# Altium schematic sheet STM3205P_CurrentMeasure.SchDoc
size A3; Organization: Canis Tech; Address1: -; Address2: -; Address3: -; Address4: Indaiatuba/SP; DocumentNumber: 7; SheetNumber: 7; SheetTotal: 9; Address5: Brazil
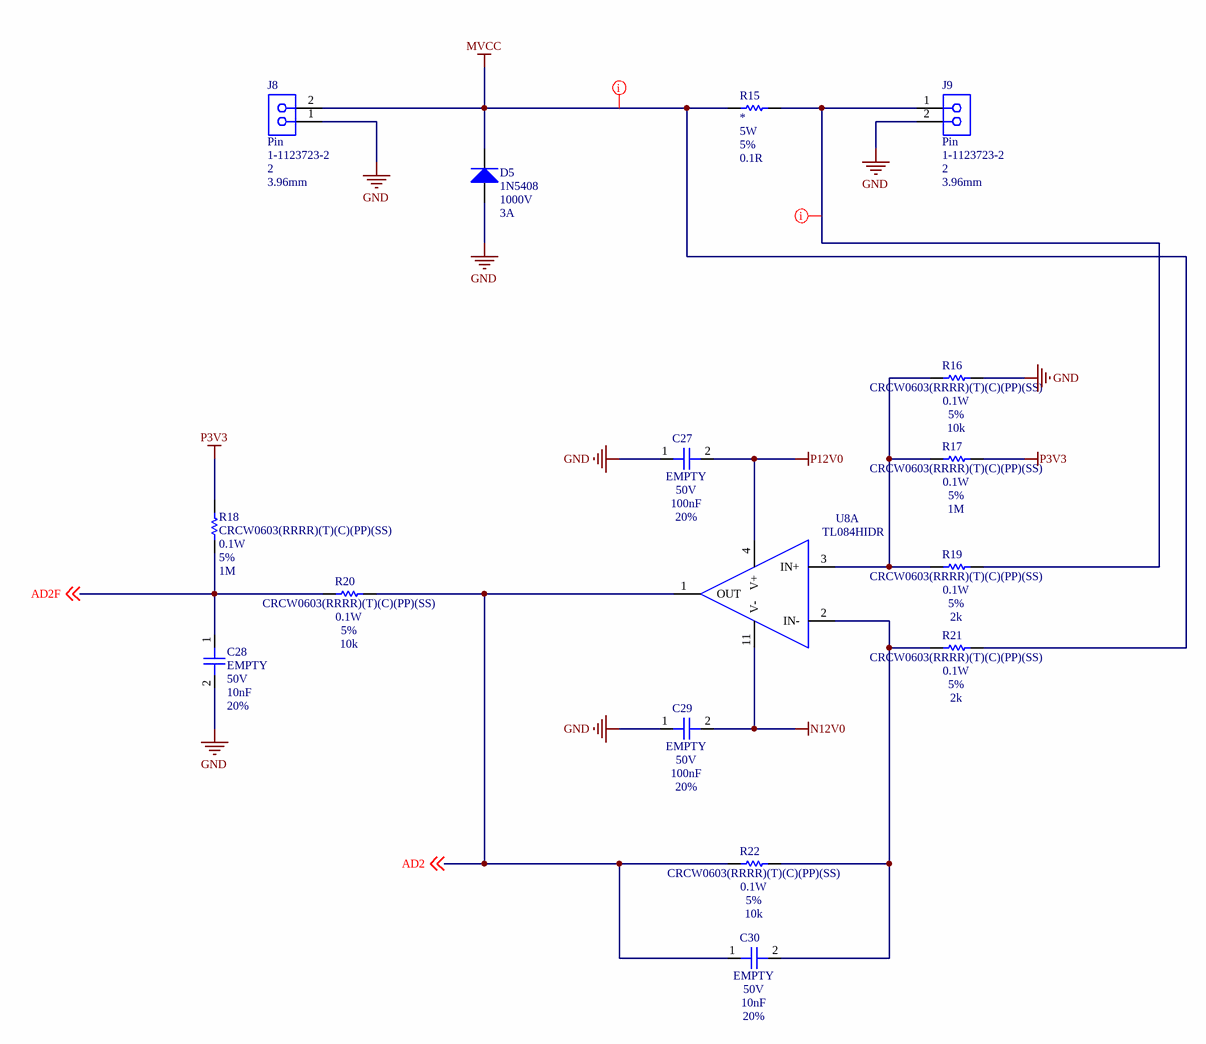
[diagram p0: STM3205P_CurrentMeasure.SchDoc]

## Parts
C27  value 100nF  PartNumber1: EMPTY  Voltage: 50V  Tolerance: 20%  [CAP0603]  (hidden comment: CC0603)
C28  value 10nF  PartNumber1: EMPTY  Voltage: 50V  Tolerance: 20%  [CAP0603]  (hidden comment: CC0603)
C29  value 100nF  PartNumber1: EMPTY  Voltage: 50V  Tolerance: 20%  [CAP0603]  (hidden comment: CC0603)
C30  value 10nF  PartNumber1: EMPTY  Voltage: 50V  Tolerance: 20%  [CAP0603]  (hidden comment: CC0603)
D5  Vrrm: 1000V  If: 3A  [DO-201AD]  (hidden comment: 1N5408)
J8  Type: Pin  Pins: 2  Pitch: 3.96mm  [CONKK02STRMALE_156]  (hidden comment: 1-1123723-2)
J9  Type: Pin  Pins: 2  Pitch: 3.96mm  [CONKK02STRMALE_156]  (hidden comment: 1-1123723-2)
R15  value 0.1R  Power: 5W  Tolerance: 5%  [RESSHUNT]  (hidden comment: Chip Resistor)
R16  value 10k  PartNumber1: CRCW0603(RRRR)(T)(C)(PP)(SS)  Power: 0.1W  Tolerance: 5%  [RES0603]  (hidden comment: Chip Resistor)
R17  value 1M  PartNumber1: CRCW0603(RRRR)(T)(C)(PP)(SS)  Power: 0.1W  Tolerance: 5%  [RES0603]  (hidden comment: Chip Resistor)
R18  value 1M  PartNumber1: CRCW0603(RRRR)(T)(C)(PP)(SS)  Power: 0.1W  Tolerance: 5%  [RES0603]  (hidden comment: Chip Resistor)
R19  value 2k  PartNumber1: CRCW0603(RRRR)(T)(C)(PP)(SS)  Power: 0.1W  Tolerance: 5%  [RES0603]  (hidden comment: Chip Resistor)
R20  value 10k  PartNumber1: CRCW0603(RRRR)(T)(C)(PP)(SS)  Power: 0.1W  Tolerance: 5%  [RES0603]  (hidden comment: Chip Resistor)
R21  value 2k  PartNumber1: CRCW0603(RRRR)(T)(C)(PP)(SS)  Power: 0.1W  Tolerance: 5%  [RES0603]  (hidden comment: Chip Resistor)
R22  value 10k  PartNumber1: CRCW0603(RRRR)(T)(C)(PP)(SS)  Power: 0.1W  Tolerance: 5%  [RES0603]  (hidden comment: Chip Resistor)
U8  TL084HIDR  [SOIC-14-3.9mm]  (part A of 4)

## Nets
GND: C27.1 C28.2 C29.1 D5.A J8.1 J9.2 R16.2
MVCC: D5.K J8.2 R15.2 R21.2
N12V0: C29.2 U8.11(V-)
P3V3: R17.2 R18.2
P12V0: C27.2 U8.4(V+)
AD2: C30.1 R20.2 R22.1 U8.1(OUT) ; off-sheet AD2
AD2F: C28.1 R18.1 R20.1 ; off-sheet AD2F
NetC30_2: C30.2 R21.1 R22.2 U8.2(IN-)
NetJ9_1: J9.1 R15.1 R19.2
NetR16_1: R16.1 R17.1 R19.1 U8.3(IN+)

## Layout directives
net class HighVoltage: MVCC, NetJ9_1

## Notes on the sheet
- Title
- Author
- Checked By
- Variant
- Size:
- Revision:
- A3
- Date:
- Project
- Time:
- Sheet
- of
- File:

## Library data of the parts
C27-C30 = CC0603: Surface Mount Multilayer Ceramic Chip Capacitors  for Commercial Applications; Manufacturer1: Yageo; Published: 19-Jun-2016; LatestRevisionDate: 19-Jun-2016; Publisher: Lucas Moraes; PackageReference: CAP0603; PackageDescription: CAP0603;2 Leads
D5 = 1N5408: Rectifiers Diode, 1000V, 3A; Manufacturer1: Diotec Semiconductor; Vf: 1.2V; Published: 26-Nov-2022; LatestRevisionDate: 26-Nov-2022; PackageReference: DO-201; Publisher: Lucas Moraes; PackageDescription: DO-201; 2 Leads; PartNumber1: 1N5408
J8 J9 = 1-1123723-2: Header Vert 3.96mm 2Pos; Manufacturer1: TE Connectivity; LastRevisionNote: Created; Gender: Male; Published: 16-Aug-2025; LatestRevisionDate: 16-Aug-2025; PackageReference: CONKK02STRMALE_156; Publisher: Lucas Moraes; PackageDescription: CONKK02STRMALE_156; 2 Leads; PartNumber1: 1-1123723-2
R15 = RESSHUNT: Thick Film Chip Resistors with CECC Approval,  available with Established Reliability; LatestRevisionDate: 18-Agu-2025; PackageReference: RESSHUNT; Publisher: Lucas Moraes; PackageDescription: RESSHUNT; 2 Leads; Published: 18-Agu-2025; Manufacturer1: *; PartNumber1: *
R16-R22 = CRCW0603: Thick Film Chip Resistors with CECC Approval,  available with Established Reliability; Manufacturer1: Vishay; LatestRevisionDate: 06-May-2016; PackageReference: 0603; Publisher: Lucas Moraes; PackageDescription: SMD 0603; 2 Leads; Published: 06-May-2016
U8 = TL084HIDR: Quad Operational Amplifiers RRIO; Manufacturer1: Texas Instruments; Published: 27-Aug-2025; LatestRevisionDate: 27-Aug-2025; LatestRevisionNote: Created; PackageReference: SOIC14; Publisher: Lucas Moraes; PackageDescription: SOIC14; 14 Leads; Datasheet: https://www.ti.com/lit/ds/symlink/tl084.pdf; PartNumber1: TL084HIDR